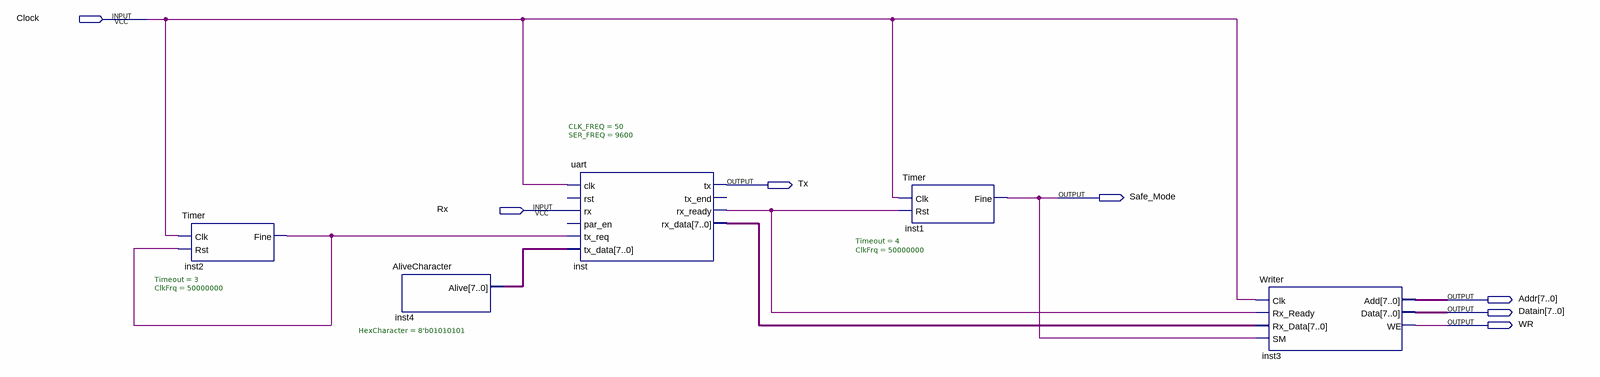
[diagram p0: schematic sheet]
// Quartus schematic COM_Raspberry.bdf as structural Verilog: 5 symbols, 7 pins
module COM_Raspberry (
  input  Clock,
  input  Rx,
  output Tx,
  output Safe_Mode,
  output [7:0] Addr,
  output [7:0] Datain,
  output WR
);

  wire inst2_fine, inst_rx_ready;
  wire [7:0] inst4_alive, inst_rx_data;

  Timer #(.Timeout(3), .ClkFrq(50000000)) inst2 (.Clk(Clock), .Rst(inst2_fine), .Fine(inst2_fine));
  AliveCharacter #(.HexCharacter(8'b01010101)) inst4 (.Alive(inst4_alive));
  uart #(.CLK_FREQ(50), .SER_FREQ(9600)) inst (
    .clk(Clock), .rx(Rx), .tx_req(inst2_fine), .tx_data(inst4_alive), .tx(Tx), .rx_ready(inst_rx_ready),
    .rx_data(inst_rx_data));  // open: rst, par_en, tx_end
  Timer #(.Timeout(4), .ClkFrq(50000000)) inst1 (.Clk(Clock), .Rst(inst_rx_ready), .Fine(Safe_Mode));
  Writer inst3 (
    .Clk(Clock), .Rx_Ready(inst_rx_ready), .Rx_Data(inst_rx_data), .SM(Safe_Mode), .Add(Addr), .Data(Datain),
    .WE(WR));
endmodule
